# Altium schematic sheet QUTMS-TSAL-V00-S04.SchDoc: Zener Voltage Regulator
size A3; DrawnBy: Joseph Richards; DocumentNumber: 5; Revision: 1; SheetNumber: 5; SheetTotal: 5
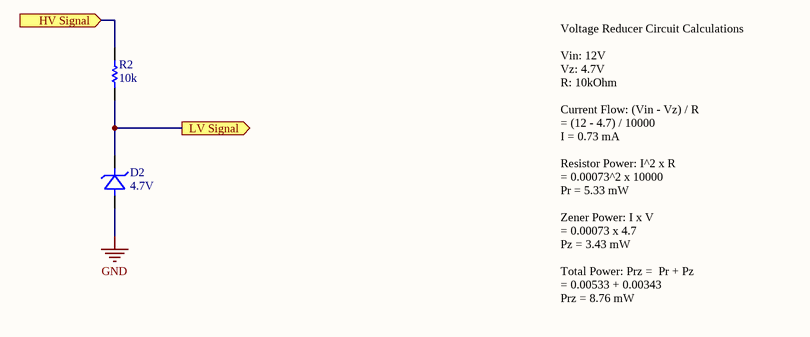
[diagram p0: QUTMS-TSAL-V00-S04.SchDoc]

## Parts
D2  4.7V  [SOD123]
R2  10k  [Res_ThinFilm_0603]

## Ports
HV Signal (in), LV Signal (out)

## Nets
GND: D2.A(Anode)
HV Signal: R2.2 ; port HV Signal
LV Signal: D2.K(Cathode) R2.1 ; port LV Signal

## Notes on the sheet
- Voltage Reducer Circuit Calculations
  Vin: 12V
  Vz: 4.7V
  R: 10kOhm
  Current Flow: (Vin - Vz) / R
  = (12 - 4.7) / 10000
  I = 0.73 mA
  Resistor Power: I^2 x R
  = 0.00073^2 x 10000
  Pr = 5.33 mW
  Zener Power: I x V
  = 0.00073 x 4.7
  Pz = 3.43 mW
  Total Power: Prz =  Pr + Pz
  = 0.00533 + 0.00343
  Prz = 8.76 mW
- Revision History:
- Sheet Title:
- Rev
- Date
- Description
- Project:
- Size:
- Drawn By:
- A3
- Number:
- Revision:
- Sheet
- Version:
- of
- QUT Motorsport
- O-120, Gardens Point
- 2 George Street
- Brisbane, QLD 4000
- Australia
- Print Date:
- Print Time:
- File Name:

## Library data of the parts
D2 = MMSZ4688T1G: MMSZ4688T1G -  Zener Single Diode, 4.7 V, 500 mW, SOD-123, 5 %, 2 Pins, 150 °C; ComponentLink1Description: Element14; ComponentLink1URL: https://au.element14.com/on-semiconductor/mmsz4688t1g/zener-voltage-vz-typ-4-7v/dp/1459118
R2 = 10k 5% 0603: Resistor, SMD, 10k, 0.1W, 5%, 0603